# Altium project PCB_Project.PrjPcb
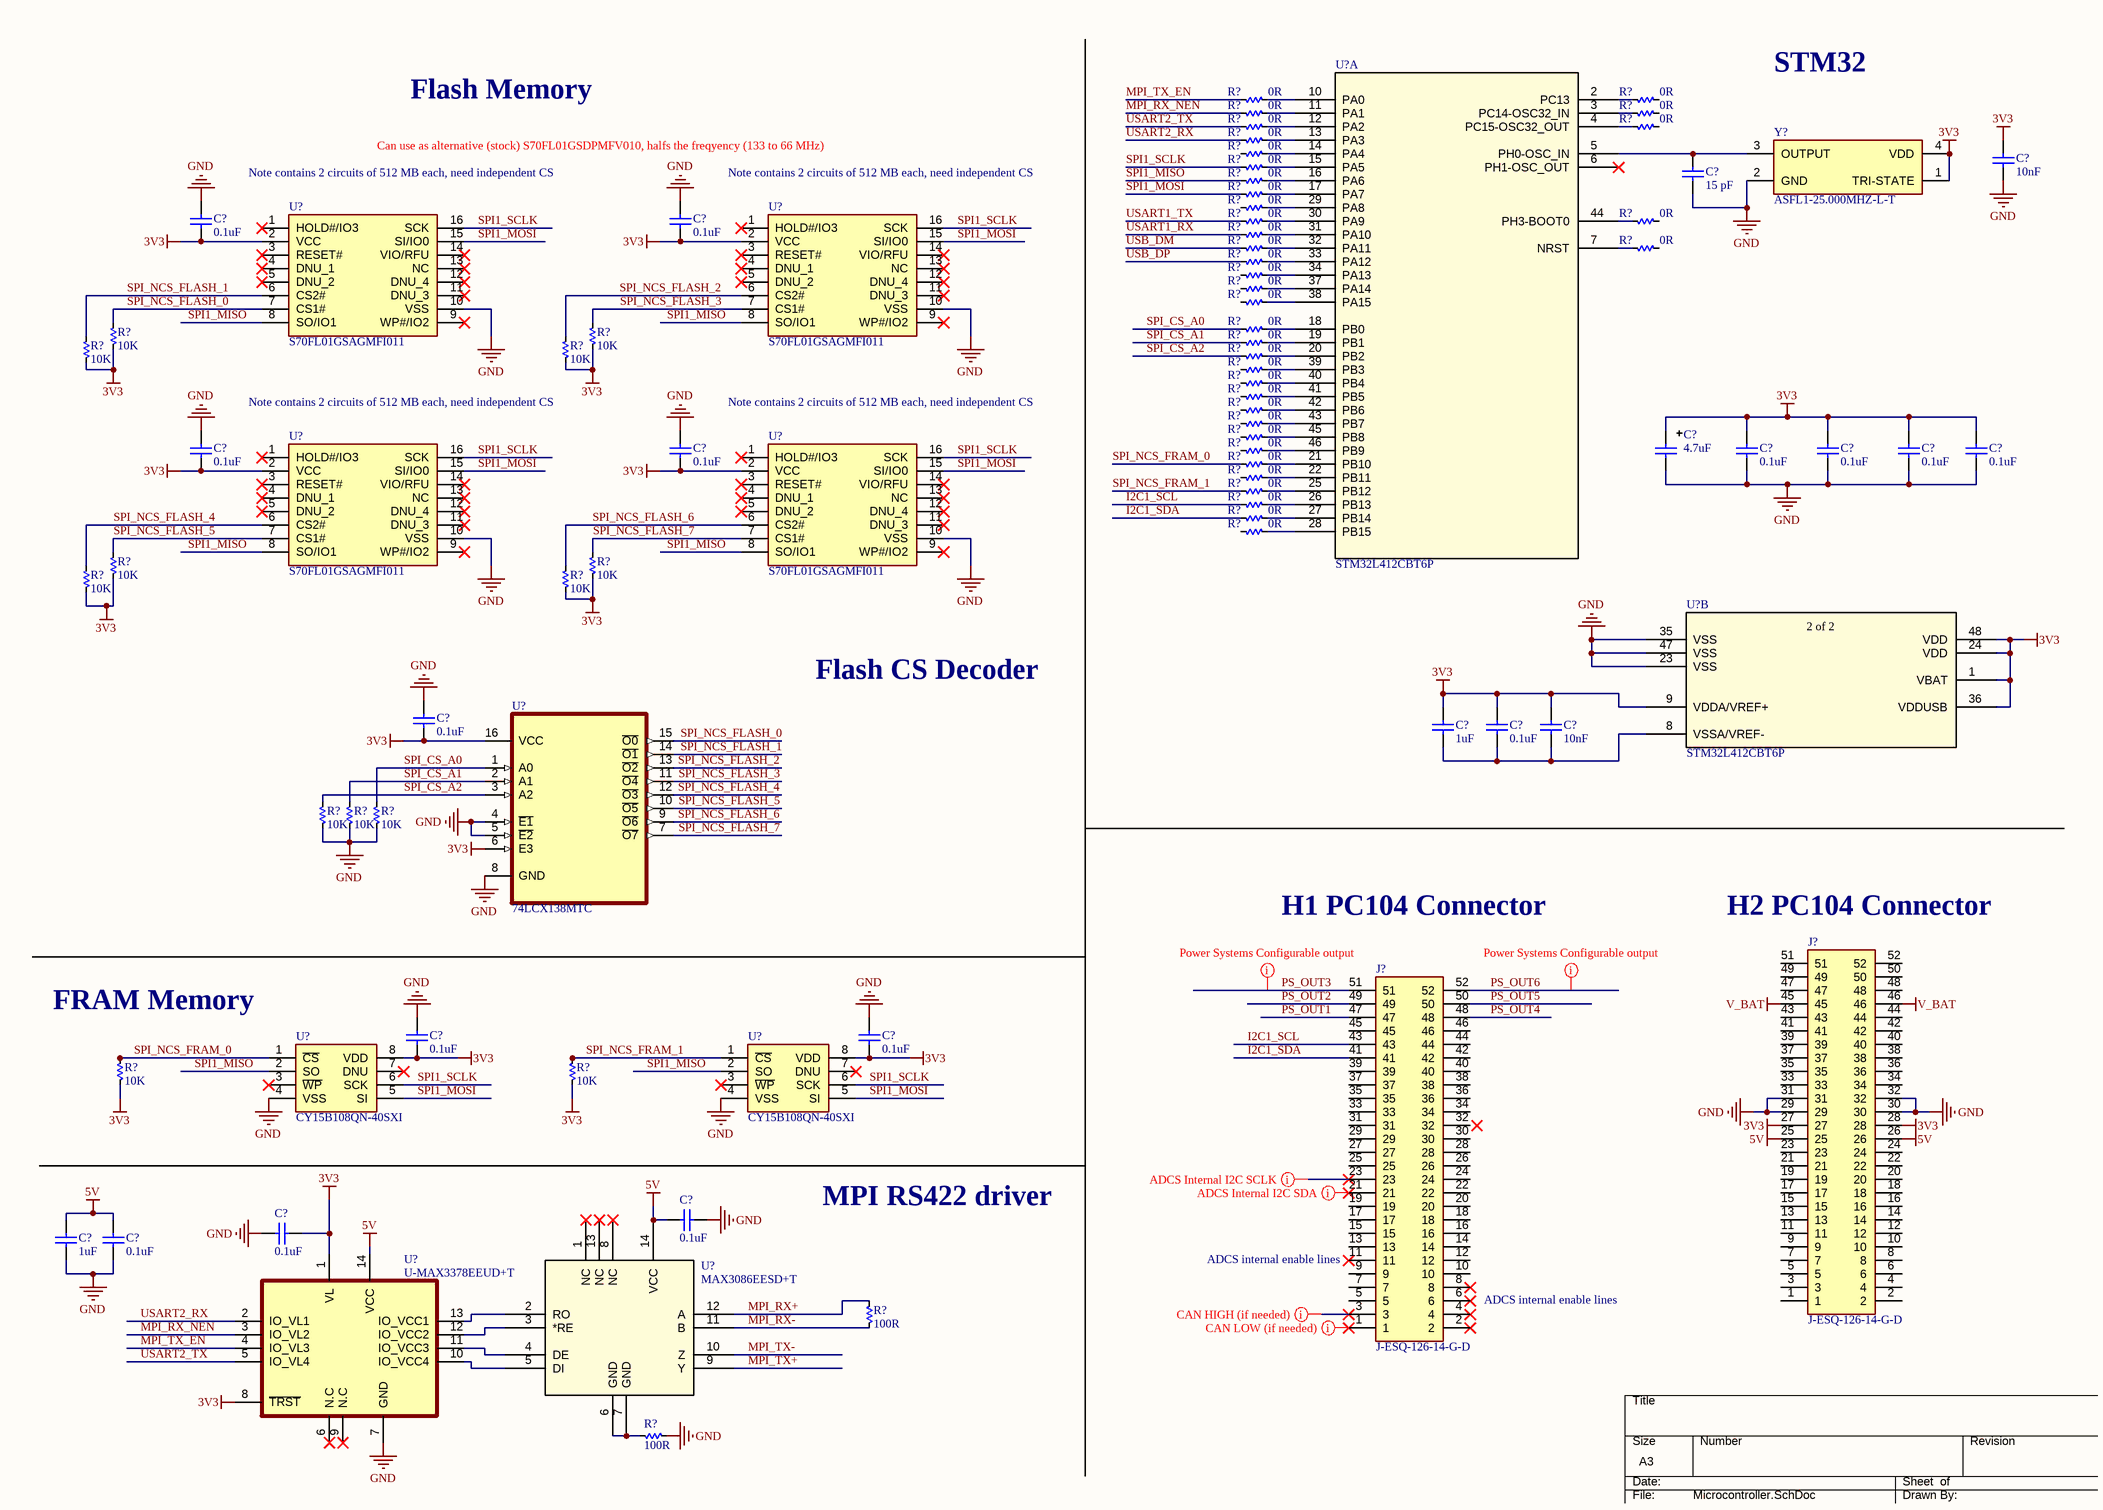
[diagram p0: Microcontroller.SchDoc]
1 sheet, 87 parts. Net scope: global (net labels, ports and power ports of the same name join across sheets).

## Sheet Microcontroller.SchDoc: Microcontroler
size A3; DrawnBy: James Chen; Revision: 1.0; SheetNumber: 1; SheetTotal: 1

### Parts
(Parts that share a designator on the sheet are numbered #1, #2 ... from top to bottom, then left to right.)
C?#1  10nF  [0402]
C?#2  15 pF  [0603]
C?#3  0.1uF  [0402]
C?#4  0.1uF  [0402]
C?#5  4.7uF  [CAP TANT 1206 (A) TCJ]
C?#6  0.1uF  [0402]
C?#7  0.1uF  [0402]
C?#8  0.1uF  [0402]
C?#9  0.1uF  [0402]
C?#10  0.1uF  [0402]
C?#11  0.1uF  [0402]
C?#12  0.1uF  [0402]
C?#13  1uF  [0603]
C?#14  0.1uF  [0402]
C?#15  10nF  [0402]
C?#16  0.1uF  [0402]
C?#17  0.1uF  [0402]
C?#18  0.1uF  [0402]
C?#19  0.1uF  [0402]
C?#20  0.1uF  [0402]
C?#21  1uF  [0603]
J?#1  J-ESQ-126-14-G-D  [J-ESQ-126-14-G-D]
J?#2  J-ESQ-126-14-G-D  [J-ESQ-126-14-G-D]
R?#1  0R  [0402]
R?#2  0R  [0402]
R?#3  0R  [0402]
R?#4  0R  [0402]
R?#5  0R  [0402]
R?#6  0R  [0402]
R?#7  0R  [0402]
R?#8  0R  [0402]
R?#9  0R  [0402]
R?#10  0R  [0402]
R?#11  0R  [0402]
R?#12  0R  [0402]
R?#13  0R  [0402]
R?#14  0R  [0402]
R?#15  0R  [0402]
R?#16  0R  [0402]
R?#17  0R  [0402]
R?#18  0R  [0402]
R?#19  0R  [0402]
R?#20  0R  [0402]
R?#21  0R  [0402]
R?#22  0R  [0402]
R?#23  0R  [0402]
R?#24  10K  [0402]
R?#25  10K  [0402]
R?#26  0R  [0402]
R?#27  10K  [0402]
R?#28  10K  [0402]
R?#29  0R  [0402]
R?#30  0R  [0402]
R?#31  0R  [0402]
R?#32  0R  [0402]
R?#33  0R  [0402]
R?#34  0R  [0402]
R?#35  0R  [0402]
R?#36  0R  [0402]
R?#37  0R  [0402]
R?#38  0R  [0402]
R?#39  0R  [0402]
R?#40  0R  [0402]
R?#41  0R  [0402]
R?#42  10K  [0402]
R?#43  10K  [0402]
R?#44  10K  [0402]
R?#45  10K  [0402]
R?#46  10K  [0402]
R?#47  10K  [0402]
R?#48  10K  [0402]
R?#49  10K  [0402]
R?#50  10K  [0402]
R?#51  100R  [0402]
R?#52  100R  [0402]
U?#1  STM32L412CBT6P  [U-STM32L412CBT6P]  (part A of 2)
U?#2  S70FL01GSAGMFI011  [U-S70FL01GSAGMFI011]
U?#3  S70FL01GSAGMFI011  [U-S70FL01GSAGMFI011]
U?#4  S70FL01GSAGMFI011  [U-S70FL01GSAGMFI011]
U?#5  S70FL01GSAGMFI011  [U-S70FL01GSAGMFI011]
U?#6  STM32L412CBT6P  [U-STM32L412CBT6P]  (part B of 2)
U?#7  74LCX138MTC  [SOP65P640X110-16N]
U?#8  CY15B108QN-40SXI  [U-CY15B108QN-40SXI]
U?#9  CY15B108QN-40SXI  [U-CY15B108QN-40SXI]
U?#10  MAX3086EESD+T  [U-MAX3086EESD+T]
U?#11  U-MAX3378EEUD+T  [U-MAX3378EEUD+T]
Y?  ASFL1-25.000MHZ-L-T  [ASFL125000MHZLT]

### Nets
3V3: C?#1.2 C?#3.1 C?#4.1 C?#5.1 C?#6.1 C?#7.1 C?#8.2 C?#9.2 C?#10.2 C?#11.2 C?#12.1 C?#13.2 C?#14.2 C?#15.2 C?#16.1 C?#17.1 C?#20.1 J?#1.27 J?#1.28 R?#24.1 R?#25.1 R?#27.1 R?#28.1 R?#42.1 R?#43.1 R?#44.1 R?#45.1 R?#49.1 R?#50.1 U?#2.2(VCC) U?#3.2(VCC) U?#4.2(VCC) U?#5.2(VCC) U?#6.1(VBAT) U?#6.9(VDDA/VREF+) U?#6.24(VDD) U?#6.36(VDDUSB) U?#6.48(VDD) U?#7.6(E3) U?#7.16(VCC) U?#8.8(VDD) U?#9.8(VDD) U?#11.1(VL) U?#11.8(~{TRST}) Y?.1(TRI-STATE) Y?.4(VDD)
5V: C?#18.1 C?#19.1 C?#21.2 J?#1.25 J?#1.26 U?#10.14(VCC) U?#11.14(VCC)
GND: C?#1.1 C?#2.1 C?#3.2 C?#4.2 C?#5.2 C?#6.2 C?#7.2 C?#8.1 C?#9.1 C?#10.1 C?#11.1 C?#12.2 C?#16.2 C?#17.2 C?#18.2 C?#19.2 C?#20.2 C?#21.1 J?#1.29 J?#1.30 J?#1.31 J?#1.32 R?#46.1 R?#47.1 R?#48.1 R?#52.1 U?#2.10(VSS) U?#3.10(VSS) U?#4.10(VSS) U?#5.10(VSS) U?#6.23(VSS) U?#6.35(VSS) U?#6.47(VSS) U?#7.4(~{E1}) U?#7.5(~{E2}) U?#7.8(GND) U?#8.4(VSS) U?#9.4(VSS) U?#11.7(GND) Y?.2(GND)
V_BAT: J?#1.45 J?#1.46
I2C1_SCL: J?#2.43 R?#39.1
I2C1_SDA: J?#2.41 R?#40.1
MPI_RX+: R?#51.2 U?#10.12(A)
MPI_RX-: R?#51.1 U?#10.11(B)
MPI_RX_NEN: R?#3.1 U?#11.3(IO_VL2)
MPI_TX+: U?#10.9(Y)
MPI_TX-: U?#10.10(Z)
MPI_TX_EN: R?#1.1 U?#11.4(IO_VL3)
PS_OUT1: J?#2.47
PS_OUT2: J?#2.49
PS_OUT3: J?#2.51
PS_OUT4: J?#2.48
PS_OUT5: J?#2.50
PS_OUT6: J?#2.52
SPI1_MISO: R?#10.1 U?#2.8(SO/IO1) U?#3.8(SO/IO1) U?#4.8(SO/IO1) U?#5.8(SO/IO1) U?#8.2(SO) U?#9.2(SO)
SPI1_MOSI: R?#11.1 U?#2.15(SI/IO0) U?#3.15(SI/IO0) U?#4.15(SI/IO0) U?#5.15(SI/IO0) U?#8.5(SI) U?#9.5(SI)
SPI1_SCLK: R?#9.1 U?#2.16(SCK) U?#3.16(SCK) U?#4.16(SCK) U?#5.16(SCK) U?#8.6(SCK) U?#9.6(SCK)
SPI_CS_A0: R?#22.1 R?#48.2 U?#7.1(A0)
SPI_CS_A1: R?#23.1 R?#47.2 U?#7.2(A1)
SPI_CS_A2: R?#26.1 R?#46.2 U?#7.3(A2)
SPI_NCS_FLASH_0: R?#24.2 U?#2.7(CS1#) U?#7.15(~{O0})
SPI_NCS_FLASH_1: R?#27.2 U?#2.6(CS2#) U?#7.14(~{O1})
SPI_NCS_FLASH_2: R?#28.2 U?#3.6(CS2#) U?#7.13(~{O2})
SPI_NCS_FLASH_3: R?#25.2 U?#3.7(CS1#) U?#7.11(~{O4})
SPI_NCS_FLASH_4: R?#44.2 U?#4.6(CS2#) U?#7.12(~{O3})
SPI_NCS_FLASH_5: R?#42.2 U?#4.7(CS1#) U?#7.10(~{O5})
SPI_NCS_FLASH_6: R?#45.2 U?#5.6(CS2#) U?#7.9(~{O6})
SPI_NCS_FLASH_7: R?#43.2 U?#5.7(CS1#) U?#7.7(~{O7})
SPI_NCS_FRAM_0: R?#36.1 R?#49.2 U?#8.1(~{CS})
SPI_NCS_FRAM_1: R?#38.1 R?#50.2 U?#9.1(~{CS})
USART1_RX: R?#15.1
USART1_TX: R?#13.1
USART2_RX: R?#7.1 U?#11.2(IO_VL1)
USART2_TX: R?#5.1 U?#11.5(IO_VL4)
USB_DM: R?#16.1
USB_DP: R?#18.1
NetC?#2_2: C?#2.2 U?#1.5(PH0-OSC_IN) Y?.3(OUTPUT)
NetC?#13_1: C?#13.1 C?#14.1 C?#15.1 U?#6.8(VSSA/VREF-)
NetR?#1_2: R?#1.2 U?#1.10(PA0)
NetR?#2_1: R?#2.1 U?#1.2(PC13)
NetR?#3_2: R?#3.2 U?#1.11(PA1)
NetR?#4_1: R?#4.1 U?#1.3(PC14-OSC32_IN)
NetR?#5_2: R?#5.2 U?#1.12(PA2)
NetR?#6_1: R?#6.1 U?#1.4(PC15-OSC32_OUT)
NetR?#7_2: R?#7.2 U?#1.13(PA3)
NetR?#8_2: R?#8.2 U?#1.14(PA4)
NetR?#9_2: R?#9.2 U?#1.15(PA5)
NetR?#10_2: R?#10.2 U?#1.16(PA6)
NetR?#11_2: R?#11.2 U?#1.17(PA7)
NetR?#12_2: R?#12.2 U?#1.29(PA8)
NetR?#13_2: R?#13.2 U?#1.30(PA9)
NetR?#14_1: R?#14.1 U?#1.44(PH3-BOOT0)
NetR?#15_2: R?#15.2 U?#1.31(PA10)
NetR?#16_2: R?#16.2 U?#1.32(PA11)
NetR?#17_1: R?#17.1 U?#1.7(NRST)
NetR?#18_2: R?#18.2 U?#1.33(PA12)
NetR?#19_2: R?#19.2 U?#1.34(PA13)
NetR?#20_2: R?#20.2 U?#1.37(PA14)
NetR?#21_2: R?#21.2 U?#1.38(PA15)
NetR?#22_2: R?#22.2 U?#1.18(PB0)
NetR?#23_2: R?#23.2 U?#1.19(PB1)
NetR?#26_2: R?#26.2 U?#1.20(PB2)
NetR?#29_2: R?#29.2 U?#1.39(PB3)
NetR?#30_2: R?#30.2 U?#1.40(PB4)
NetR?#31_2: R?#31.2 U?#1.41(PB5)
NetR?#32_2: R?#32.2 U?#1.42(PB6)
NetR?#33_2: R?#33.2 U?#1.43(PB7)
NetR?#34_2: R?#34.2 U?#1.45(PB8)
NetR?#35_2: R?#35.2 U?#1.46(PB9)
NetR?#36_2: R?#36.2 U?#1.21(PB10)
NetR?#37_2: R?#37.2 U?#1.22(PB11)
NetR?#38_2: R?#38.2 U?#1.25(PB12)
NetR?#39_2: R?#39.2 U?#1.26(PB13)
NetR?#40_2: R?#40.2 U?#1.27(PB14)
NetR?#41_2: R?#41.2 U?#1.28(PB15)
NetR?#52_2: R?#52.2 U?#10.6(GND) U?#10.7(GND)
NetU?#10_2: U?#10.2(RO) U?#11.13(IO_VCC1)
NetU?#10_3: U?#10.3(*RE) U?#11.12(IO_VCC2)
NetU?#10_4: U?#10.4(DE) U?#11.11(IO_VCC3)
NetU?#10_5: U?#10.5(DI) U?#11.10(IO_VCC4)

Not connected (* = marked no-connect by the designer): J?#1 1 2 3 4 5 6 7 8 9 10 11 12 13 14 15 16 17 18 19 20 21 22 23 24 33 34 35 36 37 38 39 40 41 42 43 44 47 48 49 50 51 52; J?#2 1* 2* 3* 4* 5 6* 7 8* 9 10 11* 12 13 14 15 16 17 18 19 20 21* 22 23* 24 25 26 27 28 29 30 31 32 33 34 35 36 37 38 39 40 42 44 45 46; R?#2 2; R?#4 2; R?#6 2; R?#8 1; R?#12 1; R?#14 2; R?#17 2; R?#19 1; R?#20 1; R?#21 1; R?#29 1; R?#30 1; R?#31 1; R?#32 1; R?#33 1; R?#34 1; R?#35 1; R?#37 1; R?#41 1; U?#1 6(PH1-OSC_OUT)*; U?#2 1(HOLD#/IO3)* 3(RESET#)* 4(DNU_1)* 5(DNU_2)* 9(WP#/IO2)* 11(DNU_3)* 12(DNU_4)* 13(NC)* 14(VIO/RFU)*; U?#3 1(HOLD#/IO3)* 3(RESET#)* 4(DNU_1)* 5(DNU_2)* 9(WP#/IO2)* 11(DNU_3)* 12(DNU_4)* 13(NC)* 14(VIO/RFU)*; U?#4 1(HOLD#/IO3)* 3(RESET#)* 4(DNU_1)* 5(DNU_2)* 9(WP#/IO2)* 11(DNU_3)* 12(DNU_4)* 13(NC)* 14(VIO/RFU)*; U?#5 1(HOLD#/IO3)* 3(RESET#)* 4(DNU_1)* 5(DNU_2)* 9(WP#/IO2)* 11(DNU_3)* 12(DNU_4)* 13(NC)* 14(VIO/RFU)*; U?#8 3(~{WP})* 7(DNU)*; U?#9 3(~{WP})* 7(DNU)*; U?#10 1(NC)* 8(NC)* 13(NC)*; U?#11 6(N.C)* 9(N.C)*

### Layout directives
mark named Power Systems Configurable output: PS_OUT3, PS_OUT6
mark named CAN LOW (if needed): NetJ?#2_1
mark named CAN HIGH (if needed): NetJ?#2_3
mark named ADCS Internal I2C SDA: NetJ?#2_21
mark named ADCS Internal I2C SCLK: NetJ?#2_23

### Notes on the sheet
- Flash Memory
- STM32
- Note contains 2 circuits of 512 MB each, need independent CS
- Can use as alternative (stock) S70FL01GSDPMFV010, halfs the freqyency (133 to 66 MHz)
- Flash CS Decoder
- H1 PC104 Connector
- (near J?#1) H2 PC104 Connector
- (near R?#49) FRAM Memory
- MPI RS422 driver
- (near J?#2) ADCS internal enable lines
- DWG NO:
- REV:
- THIS DOCUMENT AND THE DATA DISCLOSED HEREIN OR
- HEREWITH IS THE PROPERTY OF ALTIUM LIMITED AND MAY
- BE FREELY DISTRIBUTED IN WHOLE. NO RIGHTS ARE
- RESERVED OR EXPRESS OR IMPLIED WARANTEE GIVEN.
- REVISION
- DESCRIPTION
- DATE
- APPROVED
- ENG:
- APPROVALS
- PROJECT
- DSN:
- CHK:
- REFERENCE DOCUMENTS
- PROJECT REVISION:
- TITLE
- DOCUMENT REVISION:
- DESIGN ITEM:
- BOM:
- FAB DWG:
- PCB DWG:
- ASSY DWG:
- SCALE:
- A2
- SIZE
- CAGE CODE
- FILE NAME
- DWG NO.
- SHEET
- OF
- REV
- (in symbol U-STM32L412CBT6P, part B) 2 of 2

### Library data of the parts
C?#1 C?#15 = CC-104-K-25V-X7R-0402: CAP CER 10000PF 25V X7R 0402; Manufacturer: TDK Corporation; Manufacturer Part #: C1005X7R1E103K050BB; Checked By: *; ComponentLink1description: Datasheet; ComponentLink1URL: https://ds.yuden.co.jp/TYCOMPAS/ut/detail?pn=TMK105BJ104KV-F%20%20&u=M; ComponentLink2description: Manufacturer Website; Alternate Distributor Part #: *; Alternate Manufacturer: *; Alternate Manufacturer Part #: *; Created By: *; Distributor: Digikey; Distributor Part #: 445-1260-1-ND; History: *; Notes: *; Part Description: CAP CER 10000PF 25V X7R 0402; Population: *; ROHS: Yes; ComponentLink2URL: https://www.yuden.co.jp/or/; Value: 10nF
C?#2 = CC-159-J-50V-C0G-0402: 15 pF ±1% 50V Ceramic Capacitor C0G, NP0 0402 (1005 Metric); Manufacturer: YAGEO; Manufacturer Part #: CC0402FRNPO9BN150; Checked By: *; ComponentLink1Description: Datasheet; ComponentLink1URL: *; ComponentLink2Description: Manufacture Website; ComponentLink2URL: *; Created By: *; Distributor: Digikey; Distributor Part #: 311-1642-1-ND; History: *; Notes: *; Part Description: 15 pF ±1% 50V Ceramic Capacitor C0G, NP0 0402 (1005 Metric); Population: *; ROHS: *; Alternate Distributor Part #: *; Alternate Manufacturer: *; Alternate Manufacturer Part #: *; Value: 15 pF
C?#3 C?#4 C?#6-C?#12 C?#14 C?#16-C?#20 = CC-104-K-25V-X7R-0402: CAP CER 0.1UF 25V X7R 0402; Manufacturer: YAGEO; Manufacturer Part #: CC0402KPX7R8BB104; Checked By: *; ComponentLink1description: Datasheet; ComponentLink1URL: https://ds.yuden.co.jp/TYCOMPAS/ut/detail?pn=TMK105BJ104KV-F%20%20&u=M; ComponentLink2description: Manufacturer Website; Alternate Distributor Part #: *; Alternate Manufacturer: *; Alternate Manufacturer Part #: *; Created By: *; Distributor: Digikey; Distributor Part #: 13-CC0402KPX7R8BB104CT-ND; History: *; Notes: *; Part Description: CAP CER 0.1UF 25V X7R 0402; Population: *; ROHS: Yes; ComponentLink2URL: https://www.yuden.co.jp/or/; Value: 0.1uF
C?#5 = CT-474-M-20V-OTH-1206: 4.7 µF Molded Tantalum Capacitors 20 V 1206 (3216 Metric) 4Ohm; Manufacturer: AVX Corporation; Manufacturer Part #: TAJA475K020RNJ; Alternate Distributor Part #: *; Alternate Manufacturer: *; Alternate Manufacturer Part #: *; Checked By: *; ComponentLink1Description: Datasheet; ComponentLink1URL: *; ComponentLink2Description: Manufacturer Website; ComponentLink2URL: *; Created By: *; Distributor: Digikey; Distributor Part #: 478-1668-1-ND; History: *; Notes: *; Part Description: 4.7 µF Molded Tantalum Capacitors 20 V 1206 (3216 Metric) 4Ohm; Population: *; ROHS: *; SignalCraft Part #: *; Value: 4.7uF
C?#13 C?#21 = CC-105-K-25V-X7R-0603: CAP CER 1UF 25V X7R 0603; Manufacturer: Yageo; Manufacturer Part #: CC0603KRX7R8BB105; Checked By: *; ComponentLink1Description: Datasheet; ComponentLink1URL: https://www.yageo.com/upload/media/product/productsearch/datasheet/mlcc/UPY-GPHC_X7R_6.3V-to-50V_18.pdf; ComponentLink2Description: Manufacture Website; ComponentLink2URL: https://www.yageo.com/en/Home; Created By: *; Distributor: Digikey; Distributor Part #: 311-1802-1-ND; History: *; Notes: *; Part Description: CAP CER 1UF 25V X7R 0603; Population: *; ROHS: Yes; SignalCraft Part #: CC-105-K-25V-X7R-0603; Alternate Distributor Part #: *; Alternate Manufacturer: *; Alternate Manufacturer Part #: *; Value: 1uF
J?#1 J?#2 = J-ESQ-126-14-G-D: CONN SOCKET 52POS 0.1 GOLD PCB; Manufacturer: Samtec Inc.; Manufacturer Part #: ESQ-126-14-G-D; Distributor: Digikey; Distributor Part #: SAM11114-ND
R?#1-R?#23 R?#26 R?#29-R?#41 = RT-0R00-F-1/10W-0402: RES SMD 0 OHM JUMPER 1/10W 0402; Alternate Manufacturer: Yageo; Alternate Manufacturer Part #: RC0402JR-070RL; Manufacturer: Panasonic Electronic Components; Manufacturer Part #: ERJ-2GE0R00X; Checked By: *; ComponentLink1description: Datasheet; ComponentLink1URL: https://industrial.panasonic.com/ww/products/resistors/chip-resistors/general-purpose-chip-resistors/models/ERJ2GE0R00X; ComponentLink2description: Manufacturer Website; Alternate Distributor Part #: 311-0.0JRCT-ND; Created By: *; Distributor: Digikey; Distributor Part #: P0.0JCT-ND; History: *; Notes: *; Part Description: RES SMD 0 OHM JUMPER 1/10W 0402; Population: *; ROHS: Yes; ComponentLink2URL: https://industrial.panasonic.com/ww/products/resistors/chip-resistors/general-purpose-chip-resistors/models/ERJ2GE0R00X; Value: 0R
R?#24 R?#25 R?#27 R?#28 R?#42-R?#50 = RT-10K0-F-1/16W-0402: RES SMD 10K OHM 1% 1/16W 0402; Alternate Manufacturer: Yageo; Alternate Manufacturer Part #: RC0402FR-0710KL; Manufacturer: Vishay Dale; Manufacturer Part #: CRCW040210K0FKED; Checked By: *; ComponentLink1description: Datasheet; ComponentLink1URL: https://www.vishay.com/docs/20035/dcrcwe3.pdf; ComponentLink2description: Manufacturer Website; Alternate Distributor Part #: 311-10.0KLRCT-ND; Created By: *; Distributor: Digikey; Distributor Part #: 541-10.0KLCT-ND; History: *; Notes: *; Part Description: RES SMD 10K OHM 1% 1/16W 0402; Population: *; ROHS: Yes; ComponentLink2URL: https://www.vishay.com/; Value: 10K
R?#51 R?#52 = RT-100R-F-1/16W-0402: RES SMD 100 OHM 1% 1/16W 0402; Manufacturer: Yageo; Manufacturer Part #: RT0402FRE07100RL; Checked By: *; Created By: *; Distributor: Digikey; Distributor Part #: YAG3342CT-ND; History: *; Notes: *; Part Description: RES SMD 100 OHM 1% 1/16W 0402; Population: *; ROHS: *; Alternate Distributor Part #: *; Alternate Manufacturer: *; Alternate Manufacturer Part #: *; Value: 100R
U?#1 U?#6 = U-STM32L412CBT6P: IC MCU 32BIT 128KB FLASH 48LQFP; Manufacturer: STMicroelectronics; Manufacturer Part #: STM32L412CBT6P; Distributor: Digikey; Distributor Part #: STM32L412CBT6P-ND
U?#2-U?#5 = U-S70FL01GSAGMFI011: IC FLASH 1GBIT SPI/QUAD 16SOIC; Manufacturer: Cypress Semiconductor; Manufacturer Part Number: S70FL01GSAGMFI011; Distributor: Digikey; Distributor Part #: 1274-1092-ND
U?#7 = U-74LCX138MTC: IC DECODER/DEMUX 1X3:8 16TSSOP; Manufacturer: onsemi; Manufacturer Product #: 74LCX138MTC; Distributor: Digikey; Distributor Part #: 74LCX138MTC-ND
U?#8 U?#9 = U-CY15B108QN-40SXI: IC FRAM 8MBIT SPI 40MHZ 8SOIC; Manufacturer: Cypress Semiconductor; Manufacturer Part #: CY15B108QN-40SXI; Distributor: Digikey; Distributor Part #: 428-4717-ND
U?#10 = U-MAX3086EESD+T: IC TRANSCEIVER FULL 1/1 14SOIC; Manufacturer: Maxim Integrated Products; Manufacturer Part #: MAX3086EESD+T; Distributor: Digikey; Distributor Part #: MAX3086EESD+TCT-ND; RefDes: RefDes; Type: DEV
U?#11 = U-MAX3378EEUD+T: IC TRNSLTR BIDIRECTIONAL 14TSSOP; Manufacturer: Maxim Integrated; Manufacturer Part #: MAX3378EEUD+T; Distributor: Digikey; Distributor Part #: MAX3378EEUD+TCT-ND
Y? = Y-ASFL1-25.000MHZ-L-T: XTAL OSC XO 25.0000MHZ HCMOS TTL; Manufacturer: ABRACON; Manufacturer Part #: ASFL1-25.000MHZ-L-T; Distributor: Digikey; Distributor Part #: 535-10819-1-ND